# Altium project PCB_Project1.PrjPCB
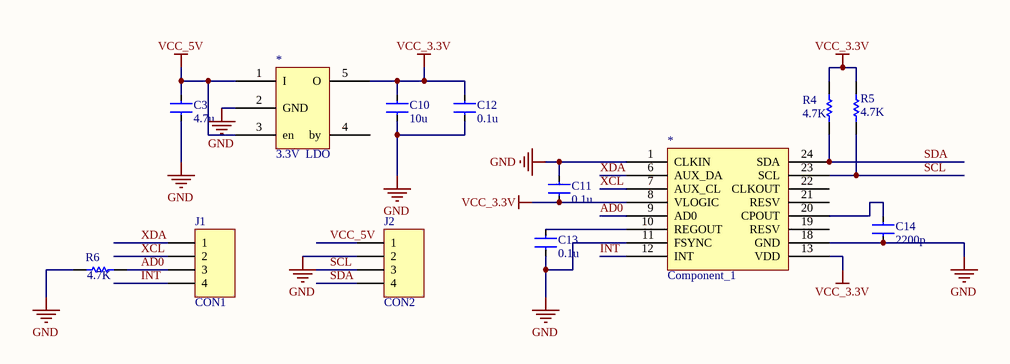
[diagram p0: Sheet1.SchDoc]
1 sheet, 13 parts. Net scope: global (net labels, ports and power ports of the same name join across sheets).
Board file: PCB1.PcbDoc

## Sheet Sheet1.SchDoc
size A4

### Parts
C3  4.7u  [1608[0603]]
C10  10u  [3.2X1.6X1.1]
C11  0.1u  [1608[0603]]
C12  0.1u  [1608[0603]]
C13  0.1u  [1608[0603]]
C14  2200p  [1608[0603]]
J1  CON1  [SH-3]
J2  CON2  [SH-3]
Q1  3.3V  LDO  [SOT235]
Q2  Component_1  [MPU6050]
R4  4.7K  [1608[0603]]
R5  4.7K  [1608[0603]]
R6  4.7K  [1608[0603]]

### Nets
GND: C3.2 C10.2 C11.1 C12.2 C13.2 C14.2 J2.2 Q1.2(GND) Q2.1(CLKIN) Q2.11(FSYNC) Q2.18(GND) R6.1
VCC_3.3V: C10.1 C11.2 C12.1 Q1.5(O) Q2.8(VLOGIC) Q2.13(VDD) R4.2 R5.2
VCC_5V: C3.1 J2.1 Q1.1(I) Q1.3(en)
AD0: J1.3 Q2.9(AD0) R6.2
INT: J1.4 Q2.12(INT)
SCL: J2.3 Q2.23(SCL) R5.1
SDA: J2.4 Q2.24(SDA) R4.1
XCL: J1.2 Q2.7(AUX_CL)
XDA: J1.1 Q2.6(AUX_DA)
NetC13_1: C13.1 Q2.10(REGOUT)
NetC14_1: C14.1 Q2.20(CPOUT)

Not connected (* = marked no-connect by the designer): Q1 4(by); Q2 19(RESV) 21(RESV) 22(CLKOUT)

### Library data of the parts
C3 C10-C14 = CAP-0.1UF: SMD-CAP
J1 J2 = Header 4: Header, 4-Pin; LatestRevisionDate: 17-Jul-2002; LatestRevisionNote: Re-released for DXP Platform.; Publisher: Altium Limited
R4-R6 = Res1: Resistor; Published: 8-Jun-2000; LatestRevisionDate: 17-Jul-2002; LatestRevisionNote: Re-released for DXP Platform.; PackageReference: AXIAL-0.3; Publisher: Altium Limited; PackageDescription: Axial Device, Thru-Hole; 2 Leads; 0.3 in Pin Spacing; Value: 4.7K